# EasyEDA Pro project TTMT_ENTIRE_EASYEDA_PROJECT.epro, schematic FlexCableLongSchematic
Board Name: 5 FlexCableLong; Create Date: 2026-05-12; Page Name: P1; Project Name: To The Moon Together - An Amateur Sounding Rocket; Schematic Name: FlexCableLongSchematic; Update Date: 2026-05-11; Company: EasyEDA.com; Page Size: A4; Version: V1.0
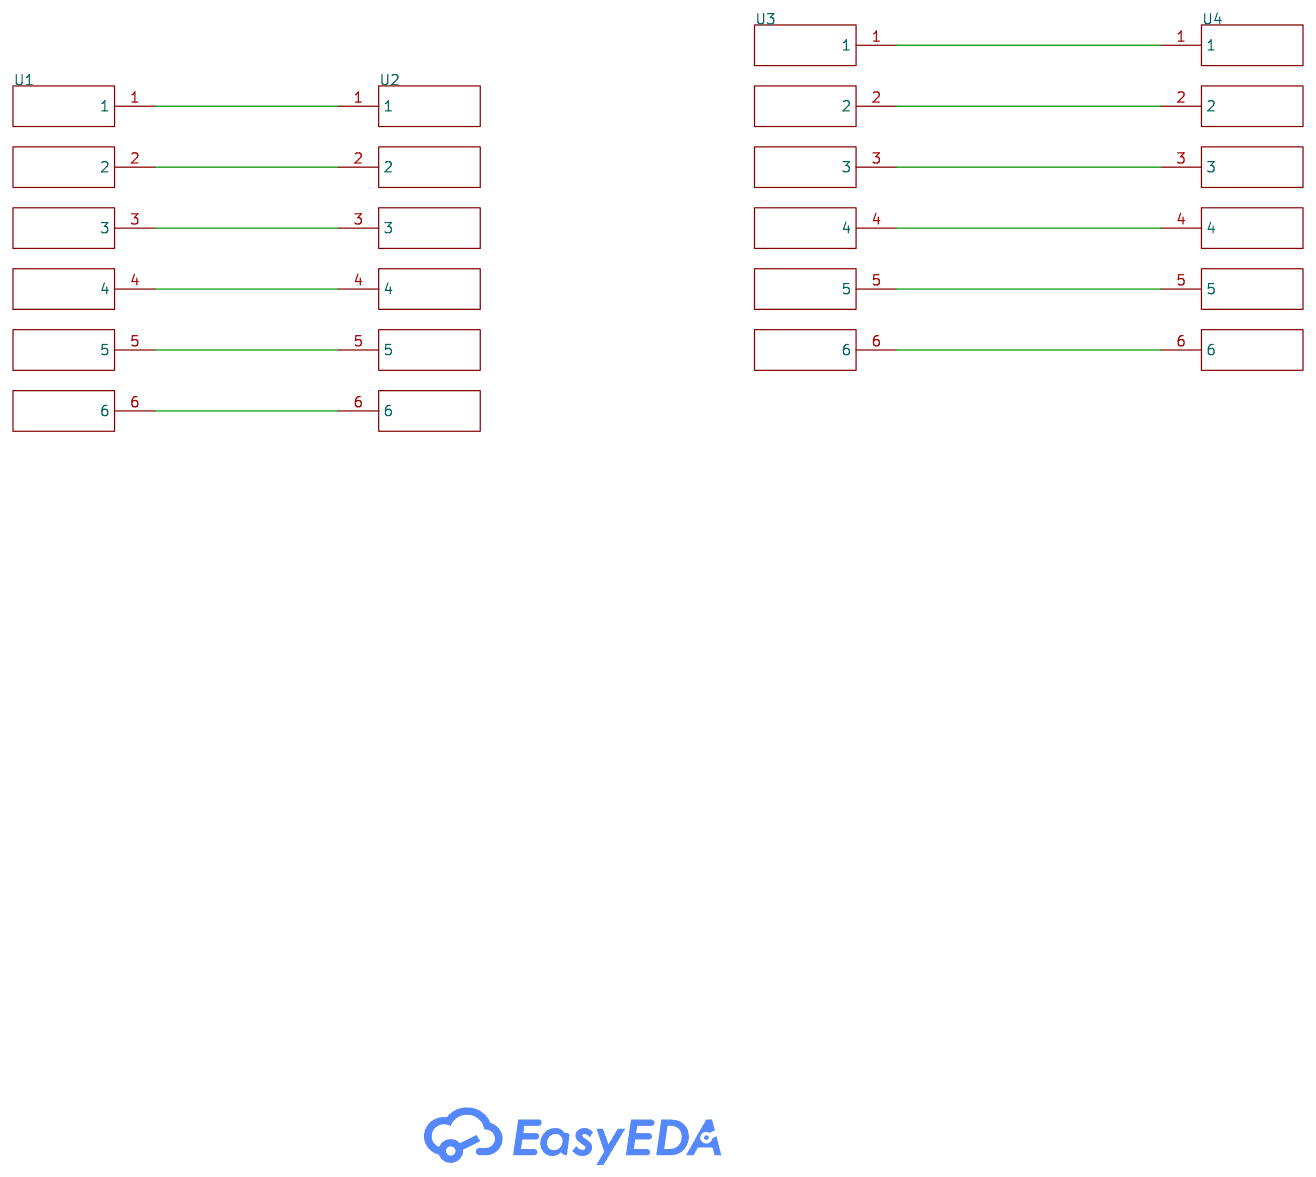
[diagram p0: schematic sheet]

## Parts
U1  -  [6pinpadtopffc]
U2  -  [6pinpadtopffc]
U3  -  [6pinpadtopffc]
U4  -  [6pinpadtopffc]

## Library data of the parts
U1-U4 = 6pinpadtopffc

## Nets
$1N163: U1.1 U2.1
$1N165: U1.2 U2.2
$1N167: U1.3 U2.3
$1N169: U1.4 U2.4
$1N171: U1.5 U2.5
$1N173: U1.6 U2.6
Net-(U3-1): U3.1 U4.1
Net-(U3-2): U3.2 U4.2
Net-(U3-3): U3.3 U4.3
Net-(U3-4): U3.4 U4.4
Net-(U3-5): U3.5 U4.5
Net-(U3-6): U3.6 U4.6
